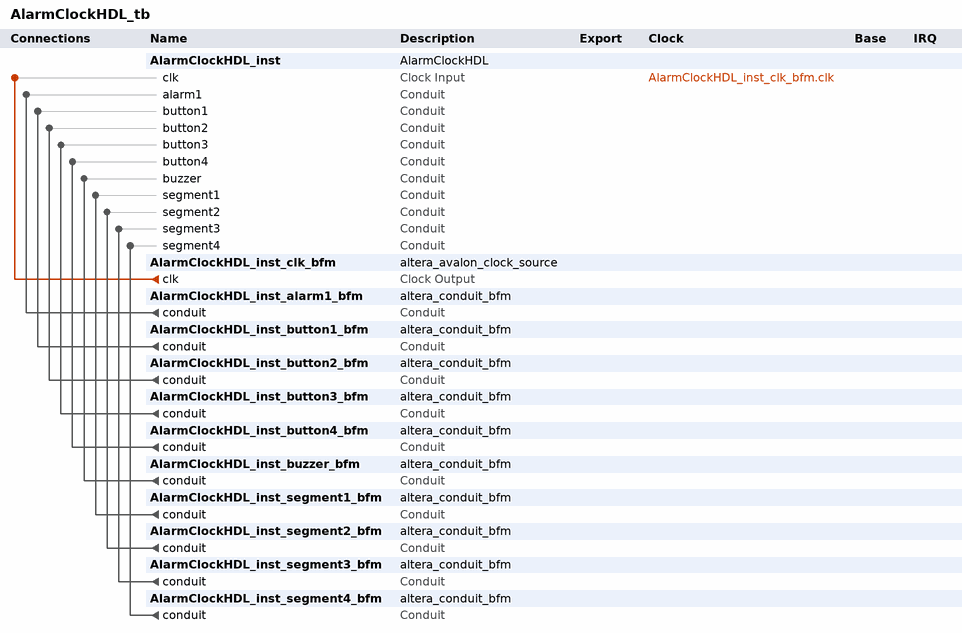
[diagram p0: system contents]
# Platform Designer (Qsys) system AlarmClockHDL_tb, Cyclone V 5CSEMA5F31C6
# Parameters at their usual value, and those the tool derives, are not listed.
package require -exact qsys 18.1
create_system AlarmClockHDL_tb
set_project_property DEVICE_FAMILY {Cyclone V}
set_project_property DEVICE 5CSEMA5F31C6

add_instance AlarmClockHDL_inst AlarmClockHDL 1.0

add_instance AlarmClockHDL_inst_clk_bfm altera_avalon_clock_source 18.1

add_instance AlarmClockHDL_inst_alarm1_bfm altera_conduit_bfm 18.1
set_instance_parameter_value AlarmClockHDL_inst_alarm1_bfm CLOCKED_SIGNAL false
set_instance_parameter_value AlarmClockHDL_inst_alarm1_bfm ENABLE_RESET false
set_instance_parameter_value AlarmClockHDL_inst_alarm1_bfm SIGNAL_DIRECTIONS output
set_instance_parameter_value AlarmClockHDL_inst_alarm1_bfm SIGNAL_WIDTHS 1

add_instance AlarmClockHDL_inst_button1_bfm altera_conduit_bfm 18.1
set_instance_parameter_value AlarmClockHDL_inst_button1_bfm CLOCKED_SIGNAL false
set_instance_parameter_value AlarmClockHDL_inst_button1_bfm ENABLE_RESET false
set_instance_parameter_value AlarmClockHDL_inst_button1_bfm SIGNAL_DIRECTIONS output
set_instance_parameter_value AlarmClockHDL_inst_button1_bfm SIGNAL_WIDTHS 1

add_instance AlarmClockHDL_inst_button2_bfm altera_conduit_bfm 18.1
set_instance_parameter_value AlarmClockHDL_inst_button2_bfm CLOCKED_SIGNAL false
set_instance_parameter_value AlarmClockHDL_inst_button2_bfm ENABLE_RESET false
set_instance_parameter_value AlarmClockHDL_inst_button2_bfm SIGNAL_DIRECTIONS output
set_instance_parameter_value AlarmClockHDL_inst_button2_bfm SIGNAL_WIDTHS 1

add_instance AlarmClockHDL_inst_button3_bfm altera_conduit_bfm 18.1
set_instance_parameter_value AlarmClockHDL_inst_button3_bfm CLOCKED_SIGNAL false
set_instance_parameter_value AlarmClockHDL_inst_button3_bfm ENABLE_RESET false
set_instance_parameter_value AlarmClockHDL_inst_button3_bfm SIGNAL_DIRECTIONS output
set_instance_parameter_value AlarmClockHDL_inst_button3_bfm SIGNAL_WIDTHS 1

add_instance AlarmClockHDL_inst_button4_bfm altera_conduit_bfm 18.1
set_instance_parameter_value AlarmClockHDL_inst_button4_bfm CLOCKED_SIGNAL false
set_instance_parameter_value AlarmClockHDL_inst_button4_bfm ENABLE_RESET false
set_instance_parameter_value AlarmClockHDL_inst_button4_bfm SIGNAL_DIRECTIONS output
set_instance_parameter_value AlarmClockHDL_inst_button4_bfm SIGNAL_WIDTHS 1

add_instance AlarmClockHDL_inst_buzzer_bfm altera_conduit_bfm 18.1
set_instance_parameter_value AlarmClockHDL_inst_buzzer_bfm CLOCKED_SIGNAL false
set_instance_parameter_value AlarmClockHDL_inst_buzzer_bfm ENABLE_RESET false
set_instance_parameter_value AlarmClockHDL_inst_buzzer_bfm SIGNAL_DIRECTIONS input
set_instance_parameter_value AlarmClockHDL_inst_buzzer_bfm SIGNAL_WIDTHS 2

add_instance AlarmClockHDL_inst_segment1_bfm altera_conduit_bfm 18.1
set_instance_parameter_value AlarmClockHDL_inst_segment1_bfm CLOCKED_SIGNAL false
set_instance_parameter_value AlarmClockHDL_inst_segment1_bfm ENABLE_RESET false
set_instance_parameter_value AlarmClockHDL_inst_segment1_bfm SIGNAL_DIRECTIONS input
set_instance_parameter_value AlarmClockHDL_inst_segment1_bfm SIGNAL_WIDTHS 7

add_instance AlarmClockHDL_inst_segment2_bfm altera_conduit_bfm 18.1
set_instance_parameter_value AlarmClockHDL_inst_segment2_bfm CLOCKED_SIGNAL false
set_instance_parameter_value AlarmClockHDL_inst_segment2_bfm ENABLE_RESET false
set_instance_parameter_value AlarmClockHDL_inst_segment2_bfm SIGNAL_DIRECTIONS input
set_instance_parameter_value AlarmClockHDL_inst_segment2_bfm SIGNAL_WIDTHS 7

add_instance AlarmClockHDL_inst_segment3_bfm altera_conduit_bfm 18.1
set_instance_parameter_value AlarmClockHDL_inst_segment3_bfm CLOCKED_SIGNAL false
set_instance_parameter_value AlarmClockHDL_inst_segment3_bfm ENABLE_RESET false
set_instance_parameter_value AlarmClockHDL_inst_segment3_bfm SIGNAL_DIRECTIONS input
set_instance_parameter_value AlarmClockHDL_inst_segment3_bfm SIGNAL_WIDTHS 7

add_instance AlarmClockHDL_inst_segment4_bfm altera_conduit_bfm 18.1
set_instance_parameter_value AlarmClockHDL_inst_segment4_bfm CLOCKED_SIGNAL false
set_instance_parameter_value AlarmClockHDL_inst_segment4_bfm ENABLE_RESET false
set_instance_parameter_value AlarmClockHDL_inst_segment4_bfm SIGNAL_DIRECTIONS input
set_instance_parameter_value AlarmClockHDL_inst_segment4_bfm SIGNAL_WIDTHS 7

# connections
add_connection AlarmClockHDL_inst_clk_bfm.clk AlarmClockHDL_inst.clk clock
add_connection AlarmClockHDL_inst_alarm1_bfm.conduit AlarmClockHDL_inst.alarm1 conduit
add_connection AlarmClockHDL_inst_button1_bfm.conduit AlarmClockHDL_inst.button1 conduit
add_connection AlarmClockHDL_inst_button2_bfm.conduit AlarmClockHDL_inst.button2 conduit
add_connection AlarmClockHDL_inst_button3_bfm.conduit AlarmClockHDL_inst.button3 conduit
add_connection AlarmClockHDL_inst_button4_bfm.conduit AlarmClockHDL_inst.button4 conduit
add_connection AlarmClockHDL_inst_buzzer_bfm.conduit AlarmClockHDL_inst.buzzer conduit
add_connection AlarmClockHDL_inst_segment1_bfm.conduit AlarmClockHDL_inst.segment1 conduit
add_connection AlarmClockHDL_inst_segment2_bfm.conduit AlarmClockHDL_inst.segment2 conduit
add_connection AlarmClockHDL_inst_segment3_bfm.conduit AlarmClockHDL_inst.segment3 conduit
add_connection AlarmClockHDL_inst_segment4_bfm.conduit AlarmClockHDL_inst.segment4 conduit

set_interconnect_requirement {$system} qsys_mm.clockCrossingAdapter HANDSHAKE
set_interconnect_requirement {$system} qsys_mm.enableEccProtection FALSE
set_interconnect_requirement {$system} qsys_mm.insertDefaultSlave FALSE
set_interconnect_requirement {$system} qsys_mm.maxAdditionalLatency 1

save_system AlarmClockHDL_tb.qsys
